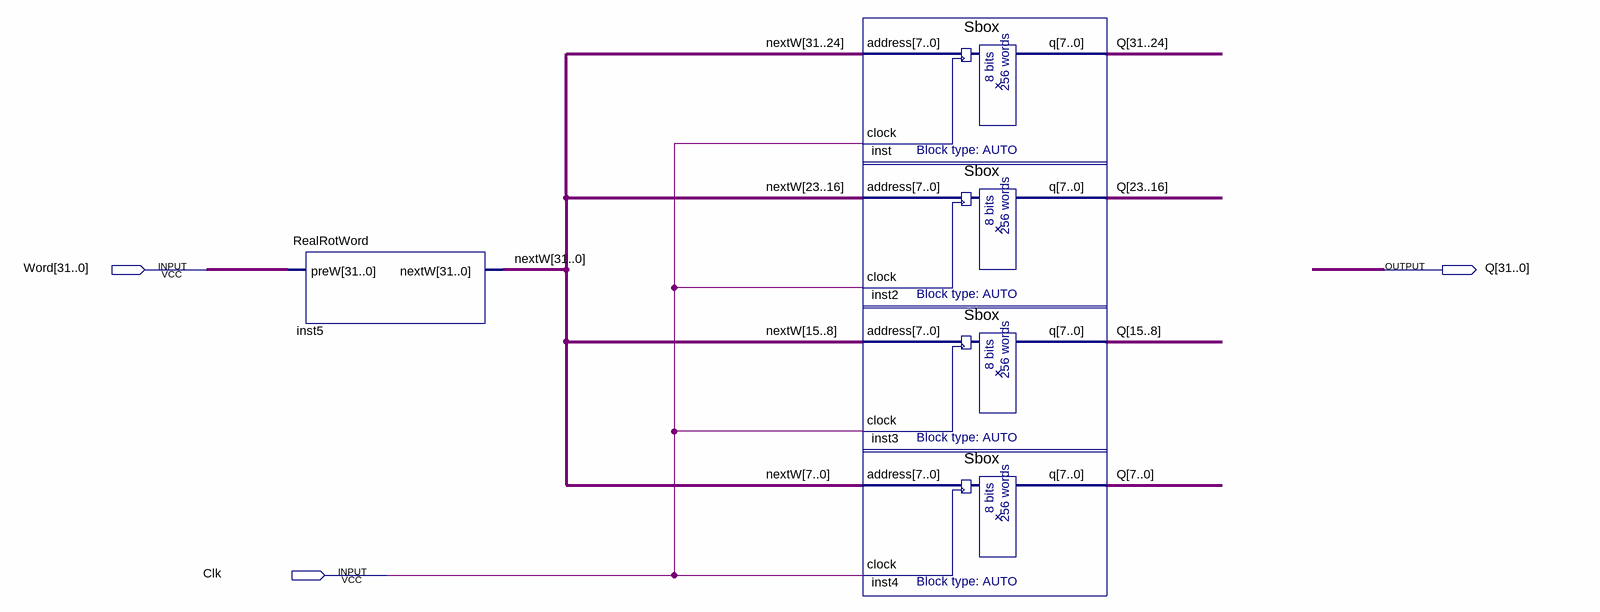
[diagram p0: schematic sheet]
// Quartus schematic AfterSbox.bdf as structural Verilog: 5 symbols, 3 pins
module AfterSbox (
  input  [31:0] Word,
  input  Clk,
  output [31:0] Q
);

  wire [31:0] nextW;

  RealRotWord inst5 (.preW(Word), .nextW(nextW));
  Sbox inst (.address(nextW[31:24]), .clock(Clk), .q(Q[31:24]));
  Sbox inst2 (.address(nextW[23:16]), .clock(Clk), .q(Q[23:16]));
  Sbox inst3 (.address(nextW[15:8]), .clock(Clk), .q(Q[15:8]));
  Sbox inst4 (.address(nextW[7:0]), .clock(Clk), .q(Q[7:0]));
endmodule
